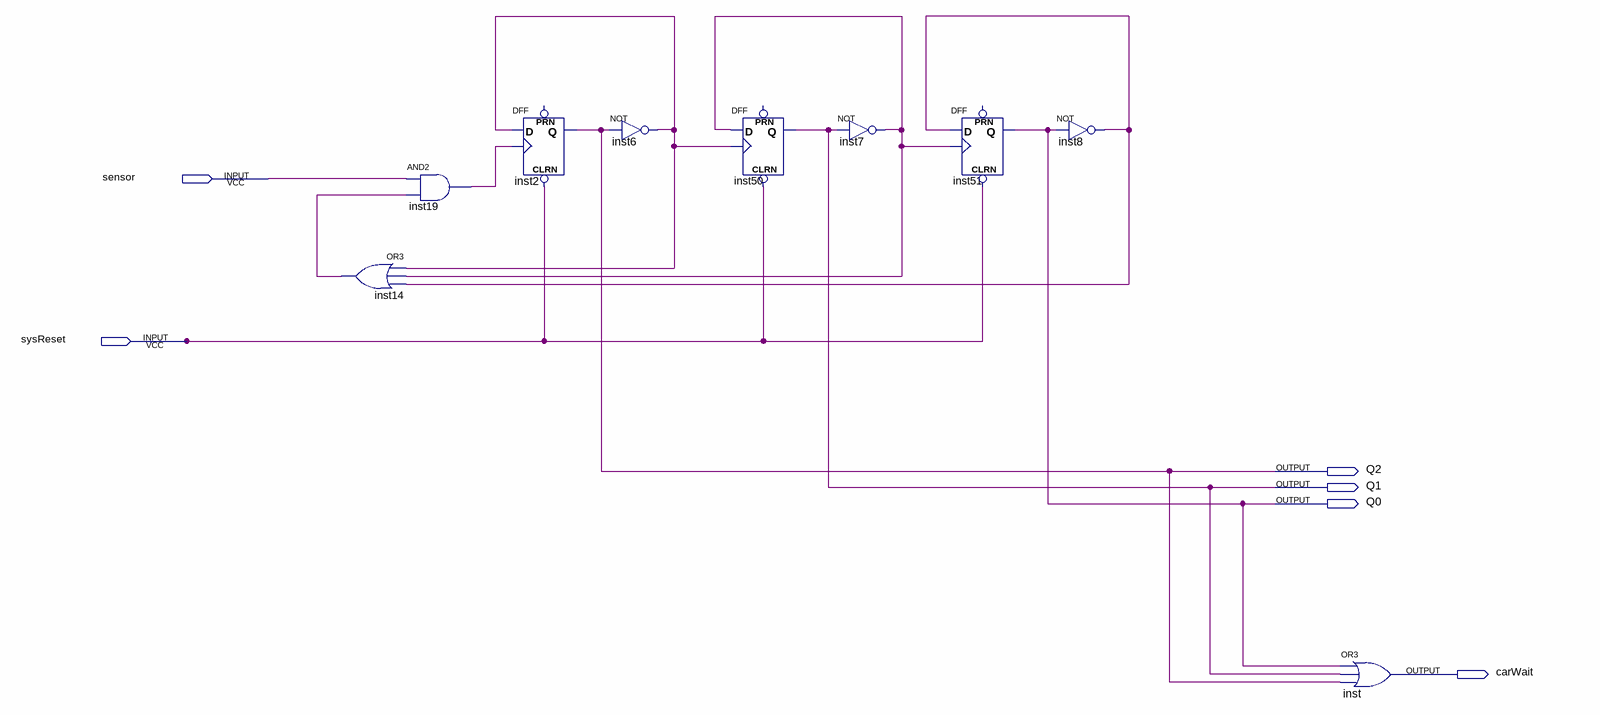
[diagram p0: schematic sheet]
// Quartus schematic carCounter.bdf as structural Verilog: 9 symbols, 6 pins
module carCounter (
  input  sensor,
  input  sysReset,
  output Q2,
  output Q1,
  output Q0,
  output carWait
);

  wire inst6_out, inst7_out, inst8_out, inst14_out, inst19_out;

  or inst14 (inst14_out, inst6_out, inst7_out, inst8_out);
  and inst19 (inst19_out, sensor, inst14_out);
  DFF inst2 (.CLRN(sysReset), .CLK(inst19_out), .D(inst6_out), .Q(Q2));  // open: PRN
  not inst6 (inst6_out, Q2);
  DFF inst50 (.CLRN(sysReset), .CLK(inst6_out), .D(inst7_out), .Q(Q1));  // open: PRN
  not inst7 (inst7_out, Q1);
  DFF inst51 (.CLRN(sysReset), .CLK(inst7_out), .D(inst8_out), .Q(Q0));  // open: PRN
  not inst8 (inst8_out, Q0);
  or inst (carWait, Q0, Q1, Q2);
endmodule
